# EAGLE design Humidity_TI (EAGLE 9.6.2)
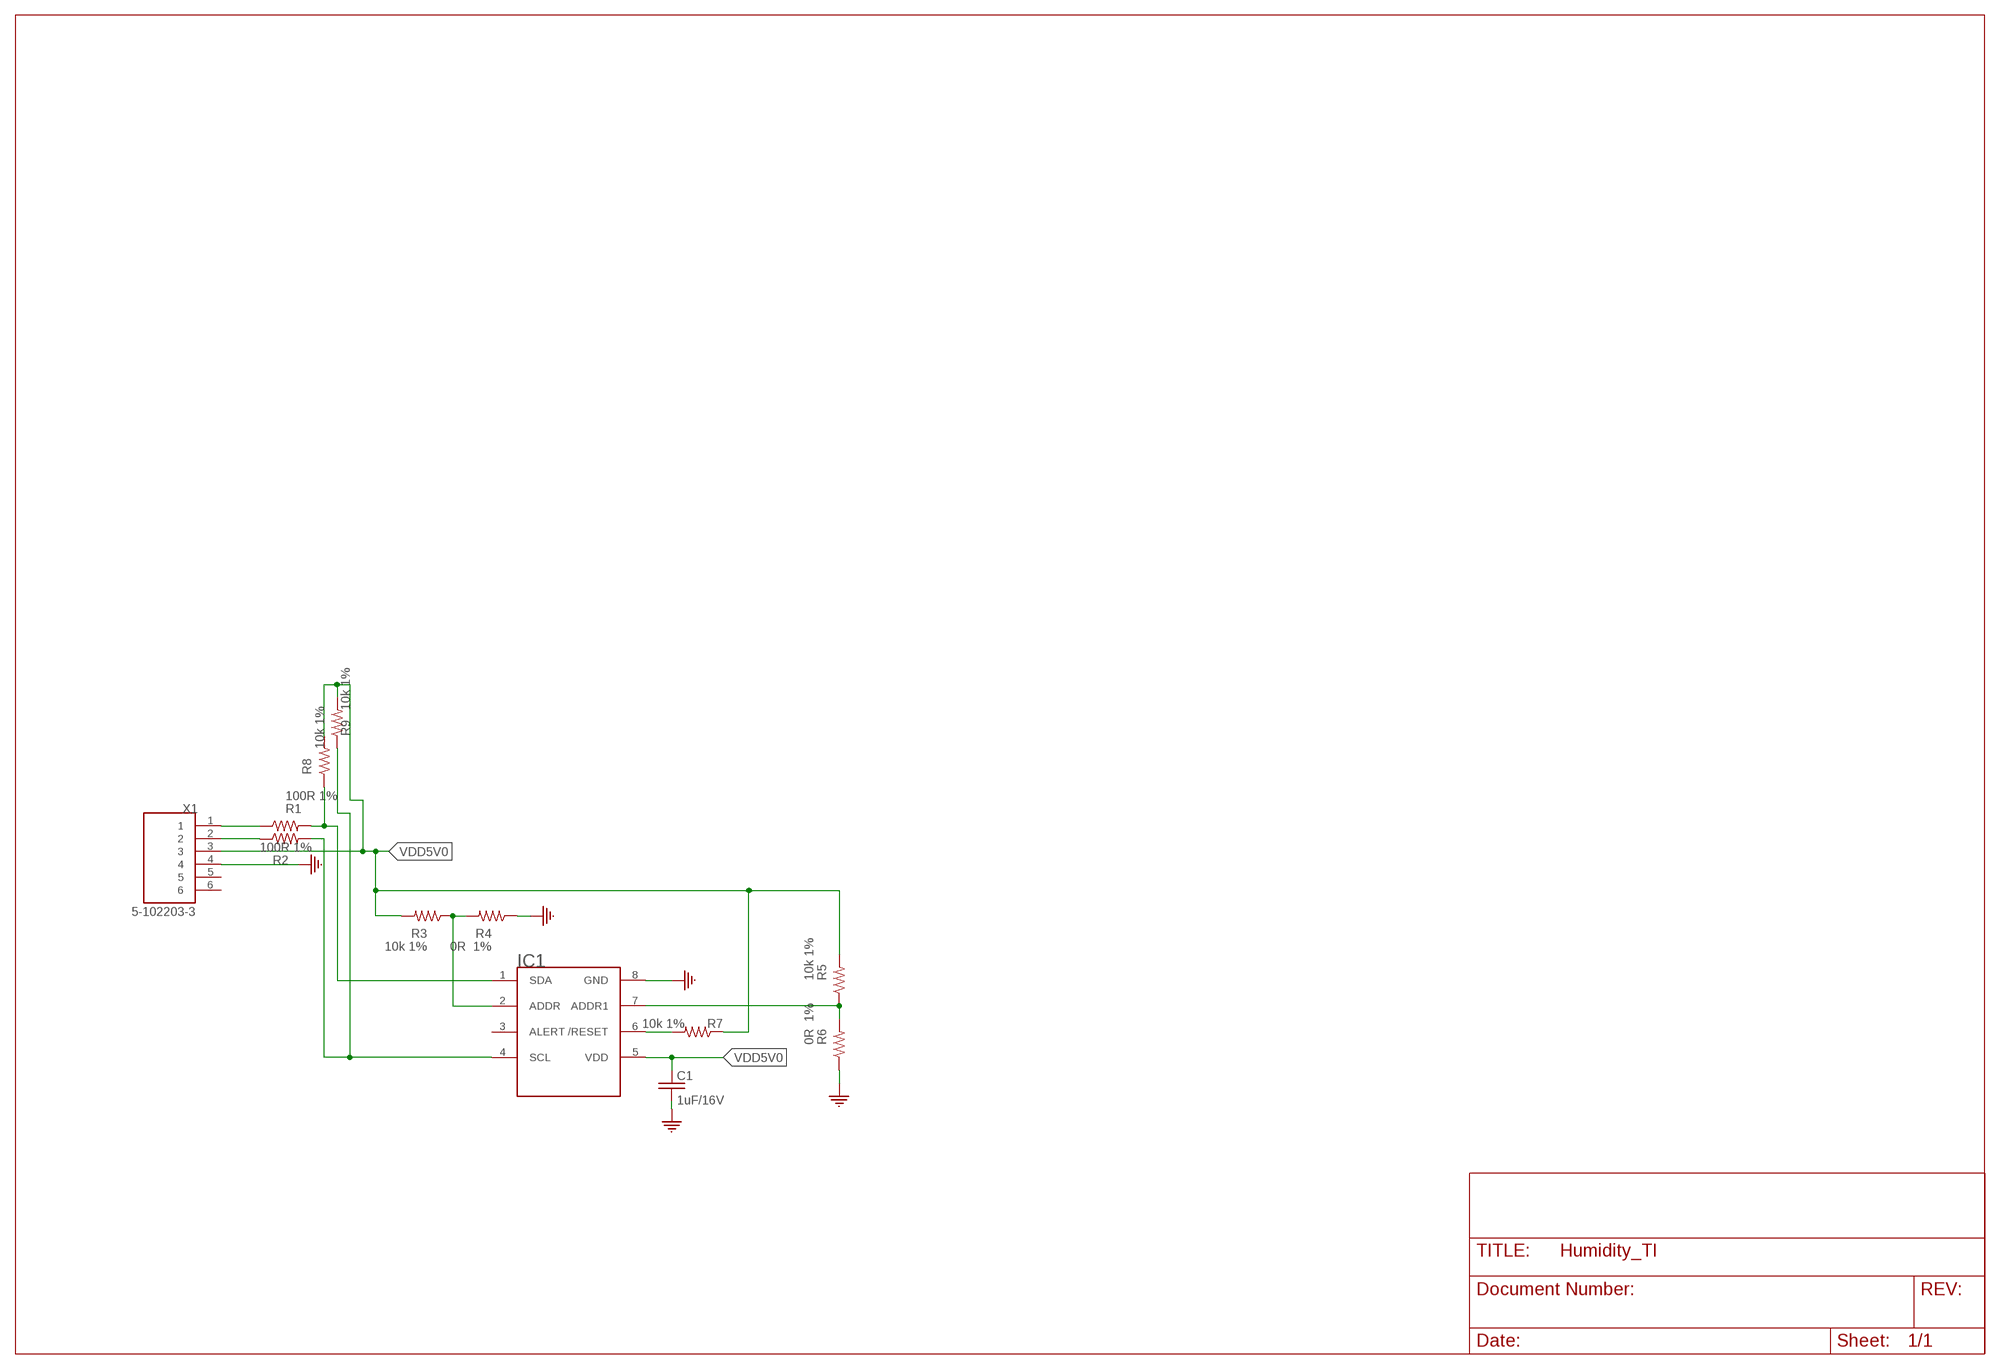
[diagram p0: schematic, sheet 1]

## Parts
C1  1uF/16V  C_0603EIA0603  [EIA0603]
IC1  HDC3021-Q1  [WSON8]
R1  100R 1%  R_0603  [EIA0603]
R2  100R 1%  R_0603  [EIA0603]
R3  10k 1%  R_0603  [EIA0603]
R4  0R 1%  R_0603  [EIA0603]
R5  10k 1%  R_0603  [EIA0603]
R6  0R 1%  R_0603  [EIA0603]
R7  10k 1%  R_0603  [EIA0603]
R8  10k 1%  R_0603  [EIA0603]
R9  10k 1%  R_0603  [EIA0603]
X1  5-102203-3  [TE_5-102203-3]

## Nets
GND: C1.2 IC1.8(GND) R4.1 R6.1 X1.4
N$1: R1.1 X1.1
N$2: IC1.1(SDA) R1.2 R8.1
N$3: IC1.4(SCL) R2.2 R9.1
N$4: R2.1 X1.2
N$5: IC1.2(ADDR) R3.1 R4.2
N$6: IC1.7(ADDR1) R5.1 R6.2
N$7: IC1.6(/RESET) R7.2
VDD5V0: C1.1 IC1.5(VDD) R3.2 R5.2 R7.1 R8.2 R9.2 X1.3
Unconnected: IC1.3(ALERT) X1.5 X1.6

## Library data of the parts
C1 = Labops_Lib_AH:C_0603
IC1 = Labops_Lib_AH:HDC3021-Q1; DESCRIPTION: Humidity sensor I2C; MFR: Texas Instruments
R1-R9 = Labops_Lib_AH:R_0603; MFN: Open Source 0603
X1 = Labops_Lib_AH:5-102203-3: 06 MODII HDR SRRA SHRD LF Check availability <https://pricing.snapeda.com/parts/5-102203-3/TE%20Connectivity/view-part?ref=eda>; COMMENT: 5-102203-3; DESCRIPTION: PCB Header, Right Angle, Shrouded, 06 HDR SRRA SHRD LF, AMPMODU Mod II Series | TE Connectivity 5-102203-3; MFN: 5-102203-3; MFR: TE Connectivity; NUMBER_OF_POSITIONS: 6; PACKAGE: None; PRODUCT_TYPE: Connector

## Board
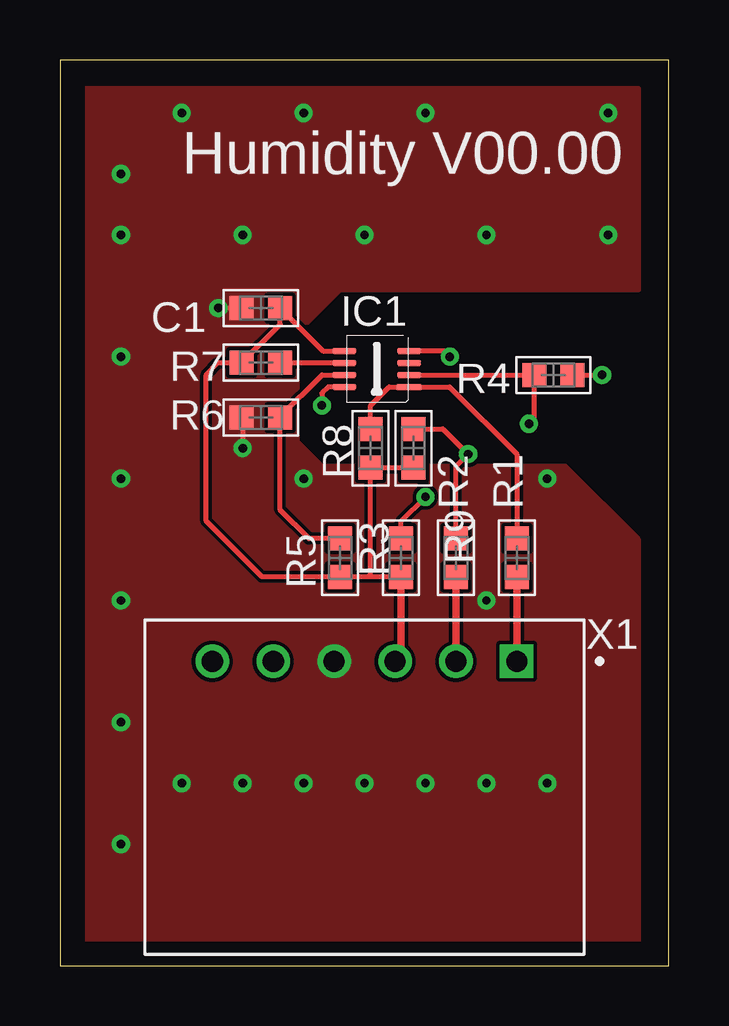
[diagram p1: board, top side]
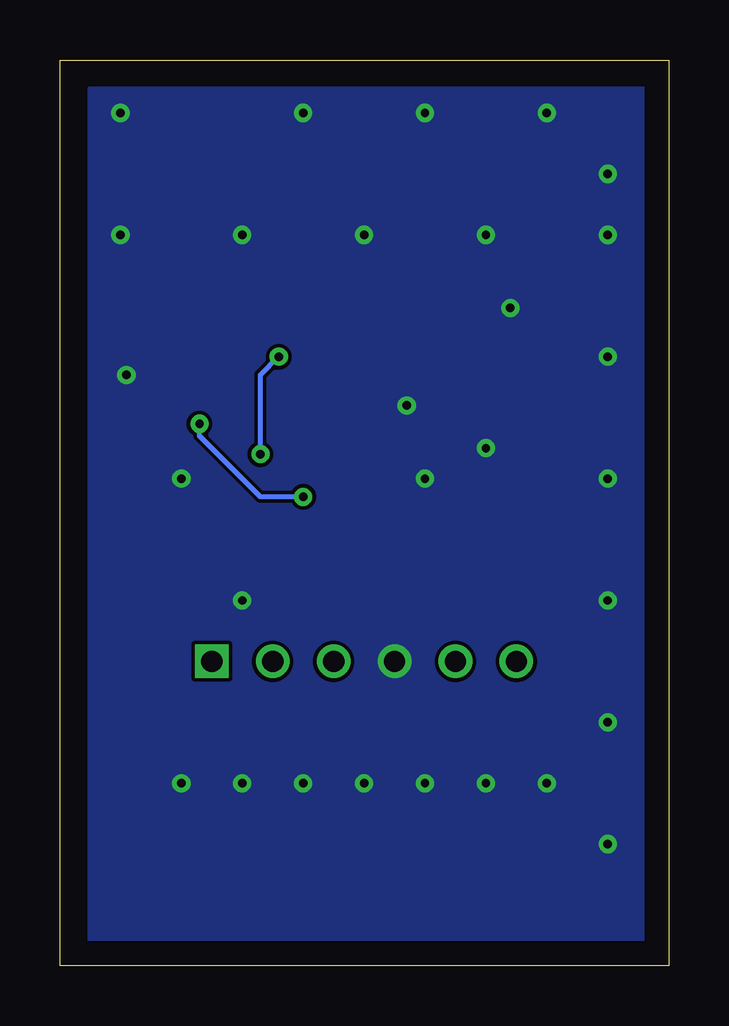
[diagram p2: board, bottom side, seen from below]

Size 25.38 x 37.77 mm. Coordinates in mm from the lower left corner, seen from the top.
Outline: 0,0 25.38,0 25.38,37.77 0,37.77 0,0
Copper layers (1*16): Top 0.035mm / dielectric 1.5mm / Bottom 0.035mm
Design rules "default": minimum track width 6mil, minimum drill 0.35mm, track to track 6mil, track to pad 6mil, pad to pad 6mil, via to via 6mil, smd to smd 6mil, copper to edge 40mil, drill to drill 6mil, minimum pad ring 10mil, minimum via ring 8mil, stop-mask expansion 4mil, vias tented up to drill 0mil, thermal gap 10mil

### Footprints (pad centres in the part's own frame; a part is rotated, then mirrored left to right if it is on the bottom)
EIA0603 = smd 1 x 1: 1 -0.8,0; 2 0.8,0
WSON8 = smd 1 x 0.25: 1 -1.35,0.75; 2 -1.35,0.25; 3 -1.35,-0.25; 4 -1.35,-0.75; 5 1.35,-0.75; 6 1.35,-0.25; 7 1.35,0.25; 8 1.35,0.75
TE_5-102203-3 = drill 0.889 square: 1 0,0 | drill 0.889: 2 2.54,0; 3 5.08,0; 4 7.62,0; 5 10.16,0; 6 12.7,0

### Placement (x,y rotation side)
C1  8.38,27.43 180 top
IC1  13.21,24.89 180 top
R1  19.05,17.02 90 top
R2  16.51,17.02 90 top
R3  14.22,17.02 270 top
R4  20.57,24.64 180 top
R5  11.68,17.02 270 top
R6  8.38,22.86 0 top
R7  8.38,25.15 0 top
R8  12.95,21.59 270 top
R9  14.73,21.59 270 top
X1  19.05,12.7 180 top

### Tracks (layer width: path | path; a pad name or v marks a point on that pad's centre or on a via)
GND  (via drill 0.35)
  Top 0.203: IC1.8 11.19,24.14 10.92,23.88 v10.92,23.37 | R4.1 v22.61,24.64 | C1.2 v6.6,27.43 | R6.1 7.62,22.82 v7.62,21.59
  other vias: 5.08,7.62 7.62,7.62 10.16,7.62 12.7,7.62 15.24,7.62 17.78,7.62 20.32,7.62 10.16,20.32 17.78,15.24 20.32,20.32 12.7,30.48 17.78,30.48 22.86,30.48 7.62,30.48 22.86,35.56 15.24,35.56 10.16,35.56 5.08,35.56 2.54,30.48 2.54,33.02 2.54,25.4 2.54,20.32 2.54,15.24 2.54,10.16 2.54,5.08
  pour Bottom (no thermals): 0.76,1.02 24.13,1.02 24.13,36.58 1.02,36.58 0.76,36.32
  pour Top (no thermals): 24.13,1.02 24.13,17.78 21.08,20.83 10.92,20.83 9.91,21.84 9.91,26.42 11.68,28.19 24.13,28.19 24.13,36.58 1.02,36.58 1.02,1.02
N$1
  Top 0.305: X1.1 R1.1
N$2
  Top 0.203: R1.2 19.05,21.34 16.24,24.14 IC1.1 13.73,24.14 12.95,23.37 R8.1
N$3  (via drill 0.35)
  Top 0.203: R2.2 16.51,20.83 v17.02,21.34 15.96,22.39 R9.1 | v16.26,25.4 16.01,25.64 IC1.4
  Bottom 0.203: v17.02,21.34 17.02,24.64 v16.26,25.4
N$4
  Top 0.305: X1.2 R2.1
N$5  (via drill 0.35)
  Top 0.203: IC1.2 R4.2 19.77,22.82 v19.56,22.61 | R3.1 14.22,18.54 v15.24,19.56
  Bottom 0.203: v15.24,19.56 17.02,19.56 19.56,22.1 v19.56,22.61
N$6
  Top 0.203: IC1.7 10.93,24.64 9.18,22.9 R6.2 9.18,19.01 10.38,17.82 R5.1
N$7
  Top 0.203: R7.2 IC1.6
VDD5V0
  Top 0.203: R3.2 12.95,16.22 | 12.95,16.22 R5.2 8.42,16.22 6.1,18.54 6.1,24.64 6.6,25.15 R7.1 9.18,26.75 C1.1 10.97,25.64 IC1.5 | 12.95,16.22 R8.2 R9.2
  Top 0.305: X1.3 14.22,12.95 R3.2

### Text on the board
tPlace: Humidity V00.00